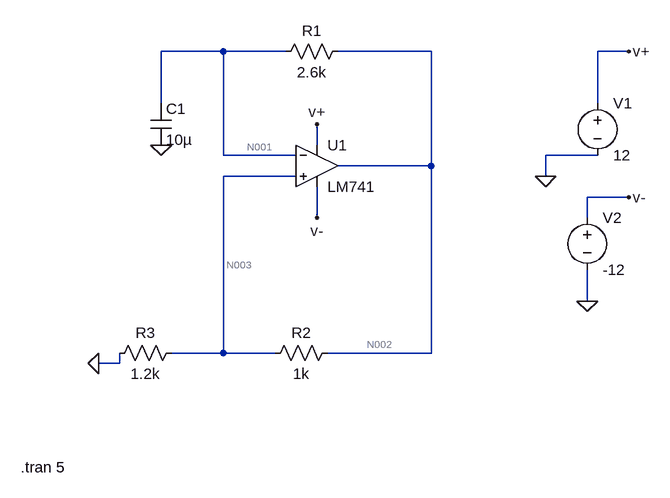
[diagram p0: schematic Oscilador de relajación con LM741.asc]
Oscilador de relajación con LM741.asc, the LTspice schematic file:
Version 4
SHEET 1 880 680
WIRE 64 -144 -32 -144
WIRE 160 -144 64 -144
WIRE 384 -144 240 -144
WIRE 688 -144 640 -144
WIRE -32 -64 -32 -144
WIRE 640 -64 640 -144
WIRE 208 0 208 -32
WIRE 64 16 64 -144
WIRE 176 16 64 16
WIRE 640 16 560 16
WIRE 384 32 384 -144
WIRE 384 32 240 32
WIRE 176 48 64 48
WIRE 560 48 560 16
WIRE 688 80 624 80
WIRE 208 112 208 64
WIRE 624 112 624 80
WIRE 624 240 624 192
WIRE 64 320 64 48
WIRE 64 320 -16 320
WIRE 144 320 64 320
WIRE 384 320 384 32
WIRE 384 320 224 320
WIRE -96 336 -96 320
WIRE -96 336 -128 336
FLAG -32 0 0
FLAG -128 336 0
FLAG 208 -32 v+
FLAG 208 112 v-
FLAG 624 240 0
FLAG 560 48 0
FLAG 688 -144 v+
FLAG 688 80 v-
SYMBOL res 256 -160 R90
WINDOW 0 0 56 VBottom 2
WINDOW 3 32 56 VTop 2
SYMATTR InstName R1
SYMATTR Value 2.6k
SYMBOL res 240 304 R90
WINDOW 0 0 56 VBottom 2
WINDOW 3 32 56 VTop 2
SYMATTR InstName R2
SYMATTR Value 1k
SYMBOL res 0 304 R90
WINDOW 0 0 56 VBottom 2
WINDOW 3 32 56 VTop 2
SYMATTR InstName R3
SYMATTR Value 1.2k
SYMBOL cap -48 -64 R0
SYMATTR InstName C1
SYMATTR Value 10µ
SYMBOL LM741 208 -32 R0
SYMATTR InstName U1
SYMBOL voltage 640 -80 R0
WINDOW 123 0 0 Left 0
WINDOW 39 0 0 Left 0
SYMATTR InstName V1
SYMATTR Value 12
SYMBOL voltage 624 96 R0
WINDOW 123 0 0 Left 0
WINDOW 39 0 0 Left 0
SYMATTR InstName V2
SYMATTR Value -12
TEXT -248 496 Left 2 !.tran 5

The netlist it stands for:
* Oscilador de relajación con LM741.asc
R1 N002 N001 2.6k
R2 N002 N003 1k
R3 N003 0 1.2k
C1 N001 0 10µ
XU1 N003 N001 v+ v- N002 LM741  ; pins In+ In- V+ V- OUT
V1 v+ 0 12
V2 v- 0 -12
.tran 5
.lib LM741.lib
.backanno
.end

* Results of the author's LTspice run, read from the files saved beside the schematic
* Operating Point, zero values left out:
*   V(n002) = 2.713 mV
*   V(n001) = 2.448 mV
*   V(n003) = 1.448 mV
*   V(v-) = -12 V
*   V(v+) = 12 V
*   I(R3) = 1.207 µA
*   I(R2) = 1.265 µA
*   I(R1) = 101.9 nA
*   I(V2) = 1.626 mA
*   I(V1) = -1.627 mA
*   Ix(u1:1) = 57.86 nA
*   Ix(u1:2) = 101.9 nA
*   Ix(u1:99) = 1.627 mA
*   Ix(u1:50) = -1.626 mA
*   Ix(u1:28) = -1.367 µA
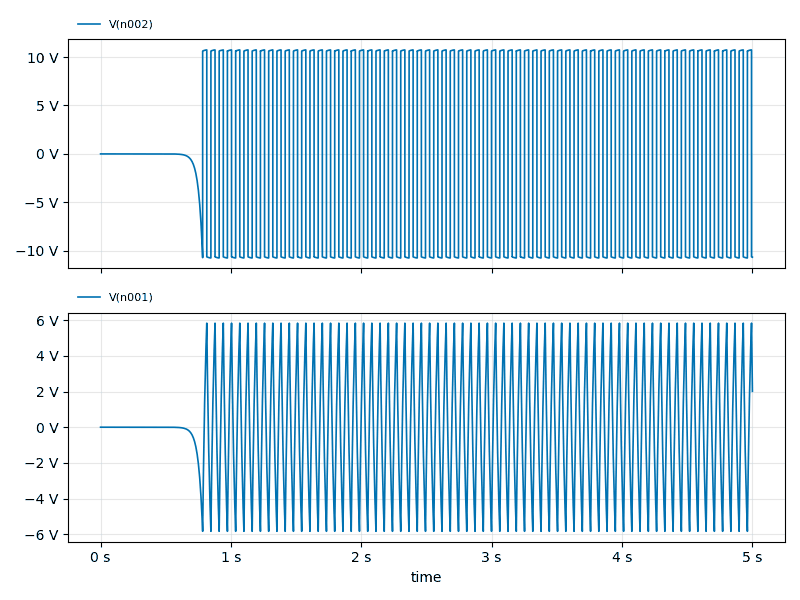
[diagram p1: Transient Analysis of Oscilador de relajación con LM741.asc, plotted from the saved traces]
* Transient Analysis, 1 run:
*   V(n002): min -10.74 V, max 10.74 V, average -12.16 mV, rms 9.832 V, last -10.66 V
*   V(n001): min -5.829 V, max 5.831 V, average -23 mV, rms 3.292 V, last 2.016 V